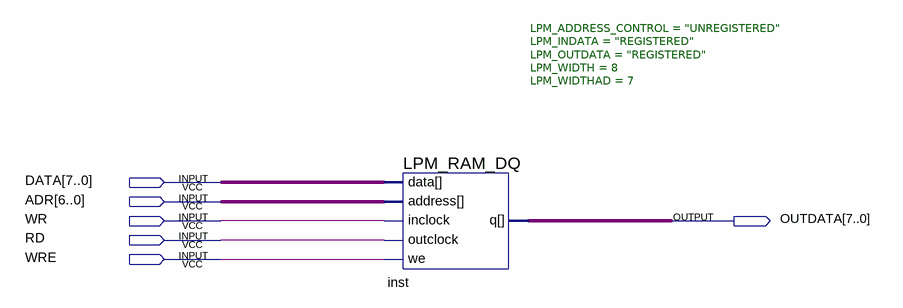
[diagram p0: schematic sheet]
// Quartus schematic MEM_8bitX7adr.bdf as structural Verilog: 1 symbols, 6 pins
module MEM_8bitX7adr (
  input  [7:0] DATA,
  input  [6:0] ADR,
  input  WR,
  input  RD,
  input  WRE,
  output [7:0] OUTDATA
);

  LPM_RAM_DQ #(.LPM_ADDRESS_CONTROL("UNREGISTERED"), .LPM_INDATA("REGISTERED"), .LPM_OUTDATA("REGISTERED"), .LPM_WIDTH(8), .LPM_WIDTHAD(7)) inst (
    .inclock(WR), .data(DATA), .address(ADR), .we(WRE), .outclock(RD), .q(OUTDATA));
endmodule
